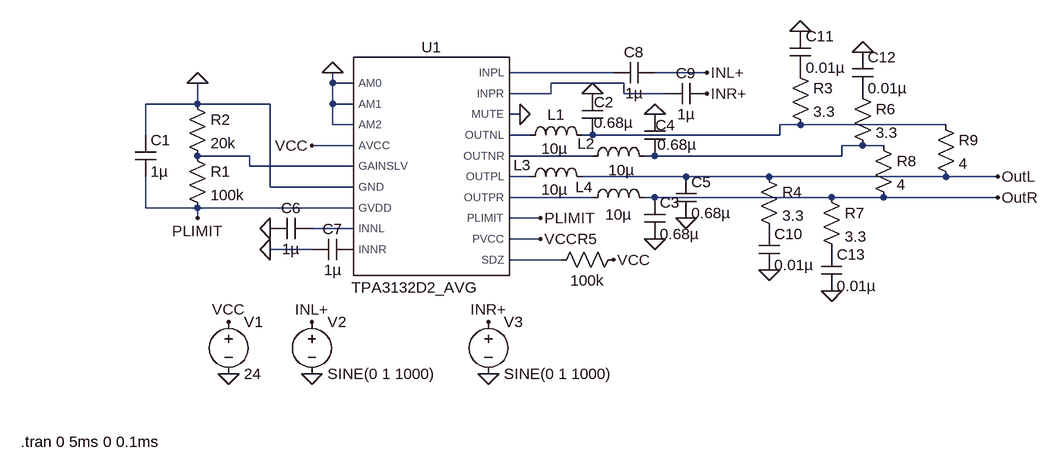
[diagram p0: schematic TPA3132.asc]
TPA3132.asc, the LTspice schematic file:
Version 4
SHEET 1 1180 680
WIRE 512 32 352 32
WIRE 656 32 576 32
WIRE 80 48 80 32
WIRE 112 48 80 48
WIRE 528 48 416 48
WIRE 416 64 416 48
WIRE 416 64 352 64
WIRE 528 64 528 48
WIRE 592 64 528 64
WIRE -128 80 -128 48
WIRE -128 80 -208 80
WIRE -16 80 -128 80
WIRE 80 80 80 48
WIRE 112 80 80 80
WIRE 368 96 352 96
WIRE 80 112 80 80
WIRE 112 112 80 112
WIRE 800 112 768 112
WIRE 1024 112 800 112
WIRE -208 128 -208 80
WIRE 384 128 352 128
WIRE 480 128 464 128
WIRE 768 128 768 112
WIRE 768 128 480 128
WIRE 112 144 48 144
WIRE 896 144 864 144
WIRE 928 144 896 144
WIRE -48 160 -128 160
WIRE 480 160 352 160
WIRE 576 160 560 160
WIRE 864 160 864 144
WIRE 864 160 576 160
WIRE -48 176 -48 160
WIRE 112 176 -48 176
WIRE 384 192 352 192
WIRE 624 192 464 192
WIRE 752 192 624 192
WIRE 1024 192 752 192
WIRE 1104 192 1024 192
WIRE -16 208 -16 80
WIRE 112 208 -16 208
WIRE 480 224 352 224
WIRE 576 224 560 224
WIRE 848 224 576 224
WIRE 928 224 848 224
WIRE 1104 224 928 224
WIRE -208 240 -208 192
WIRE -128 240 -208 240
WIRE 112 240 -128 240
WIRE -128 256 -128 240
WIRE 400 256 352 256
WIRE 112 272 48 272
WIRE 400 288 352 288
WIRE 48 304 -16 304
WIRE 432 320 352 320
FLAG 400 256 PLIMIT
FLAG -128 256 PLIMIT
FLAG -128 48 0
FLAG 480 64 0
FLAG 576 96 0
FLAG 624 256 0
FLAG 576 288 0
FLAG 80 32 0
FLAG 48 144 VCC
FLAG 400 288 VCC
FLAG -80 416 VCC
FLAG -80 496 0
FLAG 48 416 INL+
FLAG 320 416 INR+
FLAG 656 32 INL+
FLAG 656 64 INR+
FLAG -16 272 0
FLAG -16 304 0
FLAG 48 496 0
FLAG 320 496 0
FLAG 368 96 0
FLAG 512 320 VCC
FLAG 800 -32 0
FLAG 896 0 0
FLAG 752 336 0
FLAG 848 368 0
FLAG 1104 192 OutL
FLAG 1104 224 OutR
SYMBOL AutoGenerated\\TPA3132D2_AVG 224 176 R0
WINDOW 3 -17 171 Top 2
SYMATTR InstName U1
SYMBOL res -144 144 R0
SYMATTR InstName R1
SYMATTR Value 100k
SYMBOL res -144 64 R0
SYMATTR InstName R2
SYMATTR Value 20k
SYMBOL cap -224 128 R0
SYMATTR InstName C1
SYMATTR Value 1µ
SYMBOL ind 368 144 R270
WINDOW 0 32 56 VTop 2
WINDOW 3 11 54 VBottom 2
SYMATTR InstName L1
SYMATTR Value 10µ
SYMBOL ind 464 176 R270
WINDOW 0 19 6 VTop 2
WINDOW 3 10 61 VBottom 2
SYMATTR InstName L2
SYMATTR Value 10µ
SYMBOL ind 368 208 R270
WINDOW 0 18 4 VTop 2
WINDOW 3 12 54 VBottom 2
SYMATTR InstName L3
SYMATTR Value 10µ
SYMBOL ind 464 240 R270
WINDOW 0 16 3 VTop 2
WINDOW 3 5 56 VBottom 2
SYMATTR InstName L4
SYMATTR Value 10µ
SYMBOL cap 560 224 R0
SYMATTR InstName C3
SYMATTR Value 0.68µ
SYMBOL cap 464 64 R0
WINDOW 0 18 13 Left 2
WINDOW 3 18 45 Left 2
SYMATTR InstName C2
SYMATTR Value 0.68µ
SYMBOL cap 560 96 R0
WINDOW 0 17 17 Left 2
WINDOW 3 20 47 Left 2
SYMATTR InstName C4
SYMATTR Value 0.68µ
SYMBOL cap 608 192 R0
SYMATTR InstName C5
SYMATTR Value 0.68µ
SYMBOL voltage -80 400 R0
WINDOW 123 0 0 Left 0
WINDOW 39 0 0 Left 0
SYMATTR InstName V1
SYMATTR Value 24
SYMBOL voltage 48 400 R0
WINDOW 123 0 0 Left 0
WINDOW 39 0 0 Left 0
SYMATTR InstName V2
SYMATTR Value SINE(0 1 1000)
SYMBOL voltage 320 400 R0
WINDOW 123 0 0 Left 0
WINDOW 39 0 0 Left 0
SYMATTR InstName V3
SYMATTR Value SINE(0 1 1000)
SYMBOL cap 48 256 R90
WINDOW 0 0 32 VBottom 2
WINDOW 3 32 32 VTop 2
SYMATTR InstName C6
SYMATTR Value 1µ
SYMBOL cap 112 288 R90
WINDOW 0 0 32 VBottom 2
WINDOW 3 32 32 VTop 2
SYMATTR InstName C7
SYMATTR Value 1µ
SYMBOL cap 576 16 R90
WINDOW 0 0 32 VBottom 2
WINDOW 3 32 32 VTop 2
SYMATTR InstName C8
SYMATTR Value 1µ
SYMBOL cap 656 48 R90
WINDOW 0 0 32 VBottom 2
WINDOW 3 32 32 VTop 2
SYMATTR InstName C9
SYMATTR Value 1µ
SYMBOL res 528 304 R90
WINDOW 0 0 56 VBottom 2
WINDOW 3 32 56 VTop 2
SYMATTR InstName R5
SYMATTR Value 100k
SYMBOL res 784 16 R0
SYMATTR InstName R3
SYMATTR Value 3.3
SYMBOL res 736 176 R0
SYMATTR InstName R4
SYMATTR Value 3.3
SYMBOL cap 736 272 R0
SYMATTR InstName C10
SYMATTR Value 0.01µ
SYMBOL cap 784 -32 R0
SYMATTR InstName C11
SYMATTR Value 0.01µ
SYMBOL res 880 48 R0
SYMATTR InstName R6
SYMATTR Value 3.3
SYMBOL cap 880 0 R0
SYMATTR InstName C12
SYMATTR Value 0.01µ
SYMBOL res 832 208 R0
SYMATTR InstName R7
SYMATTR Value 3.3
SYMBOL cap 832 304 R0
SYMATTR InstName C13
SYMATTR Value 0.01µ
SYMBOL res 912 128 R0
SYMATTR InstName R8
SYMATTR Value 4
SYMBOL res 1008 96 R0
SYMATTR InstName R9
SYMATTR Value 4
TEXT -400 600 Left 2 !.tran 0 5ms 0 0.1ms

The netlist it stands for:
* TPA3132.asc
XU1 0 0 0 VCC N006 0 PLIMIT N010 P001 N001 N002 0 N004 N007 N008 N009 PLIMIT VCC N011 TPA3132D2_AVG  ; pins AM0 AM1 AM2 AVCC GAINSLV GND GVDD INNL INNR INPL INPR MUTE OUTNL OUTNR OUTPL OUTPR PLIMIT PVCC SDZ
R1 N006 PLIMIT 100k
R2 0 N006 20k
C1 0 PLIMIT 1µ
L1 N004 N003 10µ
L2 N007 N005 10µ
L3 N008 OutL 10µ
L4 N009 OutR 10µ
C3 OutR 0 0.68µ
C2 0 N003 0.68µ
C4 0 N005 0.68µ
C5 OutL 0 0.68µ
V1 VCC 0 24
V2 INL+ 0 SINE(0 1 1000)
V3 INR+ 0 SINE(0 1 1000)
C6 N010 0 1µ
C7 P001 0 1µ
C8 INL+ N001 1µ
C9 INR+ N002 1µ
R5 VCC N011 100k
R3 P002 N003 3.3
R4 OutL P003 3.3
C10 P003 0 0.01µ
C11 0 P002 0.01µ
R6 P004 N005 3.3
C12 0 P004 0.01µ
R7 OutR P005 3.3
C13 P005 0 0.01µ
R8 N005 OutR 4
R9 N003 OutL 4
.tran 0 5ms 0 0.1ms
.lib TPA3132D2_AVG.LIB
.backanno
.end